# EAGLE design MST3K Billboard (EAGLE 9.1.3)
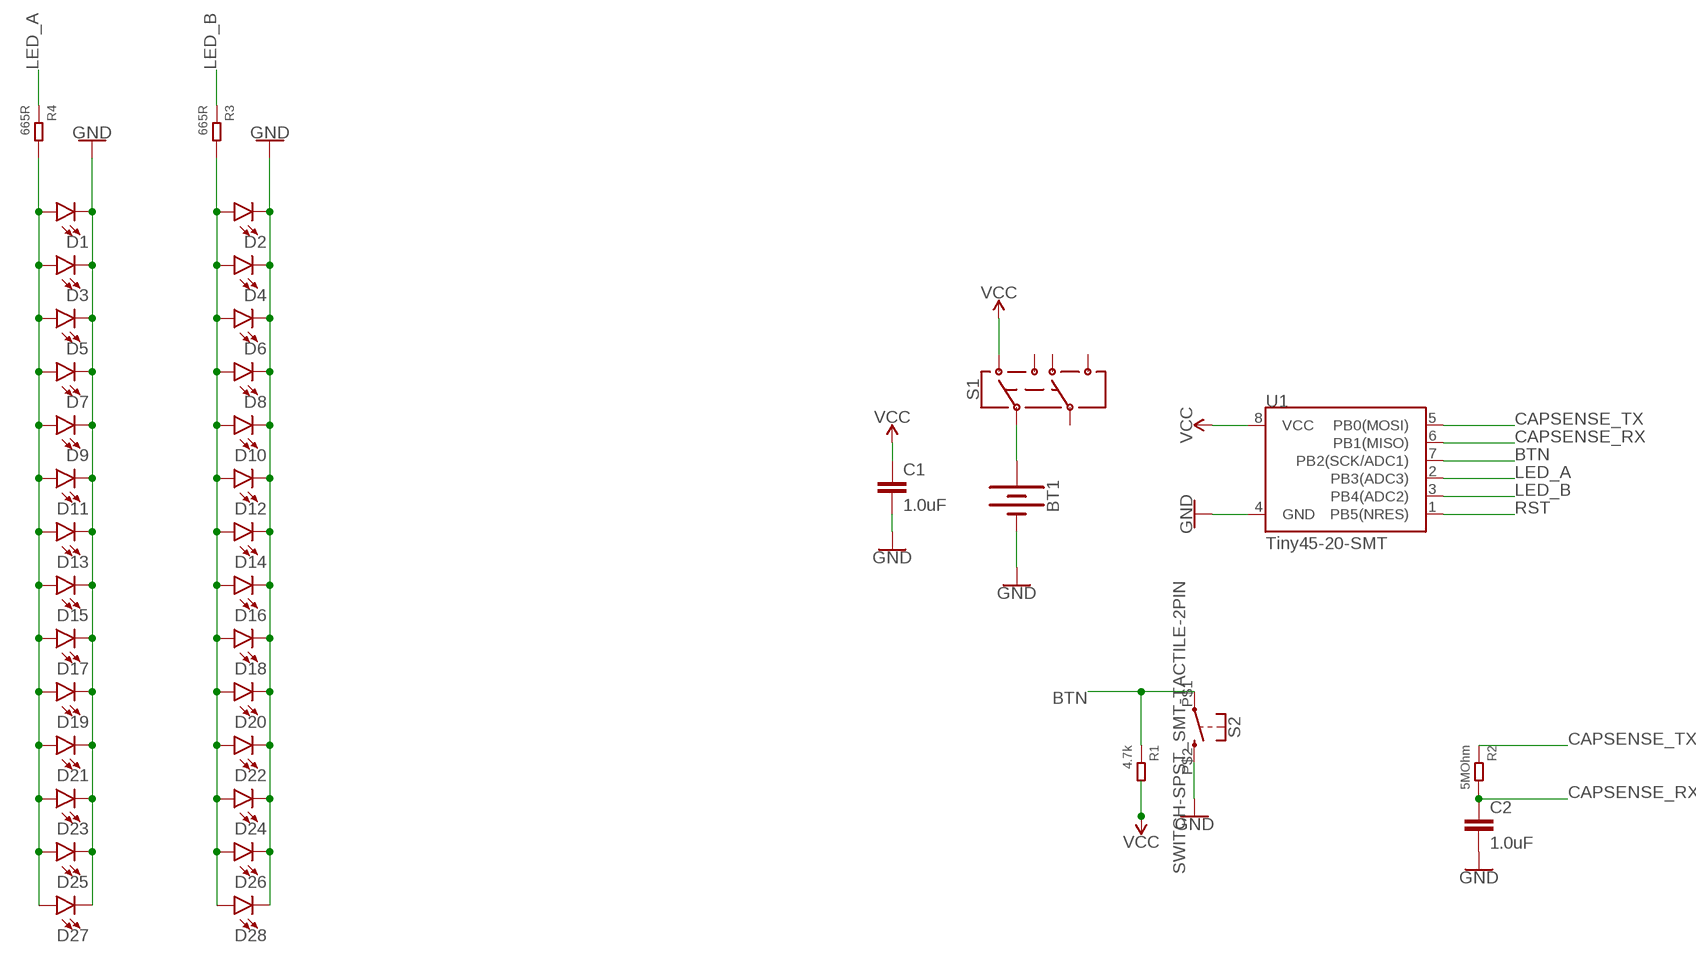
[diagram p0: schematic, sheet 1]

## Parts
BT1  BATTERY-20MM_SMD_4LEGS  [BATTCON_20MM_4LEGS]
C1  1.0uF  1.0UF-0805-25V-10%  [0805]
C2  1.0uF  1.0UF-0805-25V-10%  [0805]
D1  LED-3MM-NO_SILK  [LED_3MM-NS]
D2  LED-3MM-NO_SILK  [LED_3MM-NS]
D3  LED-3MM-NO_SILK  [LED_3MM-NS]
D4  LED-3MM-NO_SILK  [LED_3MM-NS]
D5  LED-3MM-NO_SILK  [LED_3MM-NS]
D6  LED-3MM-NO_SILK  [LED_3MM-NS]
D7  LED-3MM-NO_SILK  [LED_3MM-NS]
D8  LED-3MM-NO_SILK  [LED_3MM-NS]
D9  LED-3MM-NO_SILK  [LED_3MM-NS]
D10  LED-3MM-NO_SILK  [LED_3MM-NS]
D11  LED-3MM-NO_SILK  [LED_3MM-NS]
D12  LED-3MM-NO_SILK  [LED_3MM-NS]
D13  LED-3MM-NO_SILK  [LED_3MM-NS]
D14  LED-3MM-NO_SILK  [LED_3MM-NS]
D15  LED-3MM-NO_SILK  [LED_3MM-NS]
D16  LED-3MM-NO_SILK  [LED_3MM-NS]
D17  LED-3MM-NO_SILK  [LED_3MM-NS]
D18  LED-3MM-NO_SILK  [LED_3MM-NS]
D19  LED-3MM-NO_SILK  [LED_3MM-NS]
D20  LED-3MM-NO_SILK  [LED_3MM-NS]
D21  LED-3MM-NO_SILK  [LED_3MM-NS]
D22  LED-3MM-NO_SILK  [LED_3MM-NS]
D23  LED-3MM-NO_SILK  [LED_3MM-NS]
D24  LED-3MM-NO_SILK  [LED_3MM-NS]
D25  LED-3MM-NO_SILK  [LED_3MM-NS]
D26  LED-3MM-NO_SILK  [LED_3MM-NS]
D27  LED-3MM-NO_SILK  [LED_3MM-NS]
D28  LED-3MM-NO_SILK  [LED_3MM-NS]
R1  4.7k  SMD-RES-47R-5%-1/8W(0805)  [R0805]
R2  5MOhm  SMD-RES-47R-5%-1/8W(0805)  [R0805]
R3  665R  SMD-RES-47R-5%-1/8W(0805)  [R0805]
R4  665R  SMD-RES-47R-5%-1/8W(0805)  [R0805]
S1  SWITCH-DPDT-JS202011JCQN  [SWITCH_DPDT_SMD_JS202011JCQN]
S2  SWITCH-SPST_SMT-TACTILE-2PIN  [SMT_TACTILE_SWITCH_3X2MM]
U1  Tiny45-20-SMT  ATTINY45TINY45-20-SMT  [SO08-EIAJ_MCU]

## Nets
BTN: R1.1 S2.P$1 U1.7(PB2(SCK/ADC1))
CAPSENSE_RX: C2.1 R2.2 U1.6(PB1(MISO))
CAPSENSE_TX: R2.1 U1.5(PB0(MOSI))
GND: BT1.NEGATIVE(-) C1.2 C2.2 D1.K(C) D2.K(C) D3.K(C) D4.K(C) D5.K(C) D6.K(C) D7.K(C) D8.K(C) D9.K(C) D10.K(C) D11.K(C) D12.K(C) D13.K(C) D14.K(C) D15.K(C) D16.K(C) D17.K(C) D18.K(C) D19.K(C) D20.K(C) D21.K(C) D22.K(C) D23.K(C) D24.K(C) D25.K(C) D26.K(C) D27.K(C) D28.K(C) S2.P$2 U1.4(GND)
LED_A: R4.1 U1.2(PB3(ADC3))
LED_B: R3.1 U1.3(PB4(ADC2))
N$1: BT1.POSITIVE@1(+) BT1.POSITIVE@2(+) BT1.POSITIVE@3(+) BT1.POSITIVE@4(+) S1.P$2
OUT1: D1.A D3.A D5.A D7.A D9.A D11.A D13.A D15.A D17.A D19.A D21.A D23.A D25.A D27.A R4.2
OUT2: D2.A D4.A D6.A D8.A D10.A D12.A D14.A D16.A D18.A D20.A D22.A D24.A D26.A D28.A R3.2
RST: U1.1(PB5(NRES))
VCC: C1.1 R1.2 S1.P$1 U1.8(VCC)
Unconnected: S1.P$3 S1.P$4 S1.P$5 S1.P$6

## Library data of the parts
BT1 = SparkFun-Batteries:BATTERY: Battery - Single Cell A variety of battery chemistries, sizes, and footprints. Device List: 20MM_PTH - Coin Cell Battery Holder - 20mm (PTH) <https://www.sparkfun.com/products/783> 12MM_SMD - Coin Cell Battery Holder - 12mm (SMD) <https://www.sparkfun.com/products/10592> 12MM_PTH - Coin Cell Battery Holder - 12mm (PTH) <https://www.sparkfun.com/products/7948> 20MM_SMD - 20mm Coin Cell Battery Holder (SMD) (2 legs) Used on the Big Time Watch Kit <https://www.sparkfun.com/products/11734> 20MM_SMD_4LEGS - Coin Cell Battery Holder - 20mm (SMD) <https://www.sparkfun.com/products/11892> 20MM_SMD_4LEGS_OVERPASTE - Coin Cell Battery Holder - 20mm (SMD) <https://www.sparkfun.com/products/11892> (Over-paste on the legs) 24.5MM_PTH - Coin Cell Battery Holder - 24.5mm (PTH) <https://www.sparkfun.com/products/8863> 9V - 9V Battery Holder - PC Mount Used on the SparkFun SparkPunk Sound Kit <https://www.sparkfun.com/products/11177> and SparkFun SparkPunk Sequencer Kit <https://www.sparkfun.com/products/12707> 18650 - Battery Holder - 18650 (PTH) <https://www.sparkfun.com/products/13113> AA - Battery Holder - 1xAA (PTH) <https://www.sparkfun.com/products/7949> AAA - Battery Holder - 1xAAA (PTH) <https://www.sparkfun.com/products/12718> AA_KIT - Battery Holder - 1xAA (PTH) <https://www.sparkfun.com/products/7949> Special kit package - pads only have exposed copper on one side of the board. AAA_KIT - Battery Holder - 1xAAA (PTH) <https://www.sparkfun.com/products/12718> Special kit package - pads only have exposed copper on one side of the board.; PROD_ID: BATT-10373; SF_SKU: PRT-11892
C1 C2 = SparkFun-Capacitors:1.0UF: 1µF ceramic capacitors A capacitor is a passive two-terminal electrical component used to store electrical energy temporarily in an electric field.; PROD_ID: CAP-08064
D1-D28 = SparkFun-LED:LED: LED (Generic) Standard schematic elements and footprints for 5mm, 3mm, 1206, and 0603 sized LEDs. Generic LEDs with no color specified.
R1-R4 = Seeed-OPL-Resistor:SMD-RES-47R-5%-1/8W(0805): 301010380; MPN: RC0805JR-0747RL; VALUE: 47R
S1 = !CustomParts:SWITCH-DPDT: Double-Pole, Double-Throw (DPDT) Switch Double-pole, double-throw switches. Variant Overview PTH-GPI-152-3013 Used on SparkFun Geiger Counter <https://www.sparkfun.com/products/11345> SMD-AY0202 Surface Mount DPDT Switch <https://www.sparkfun.com/products/597> (COM-00597) Used on e.g. LilyPad Arduino USB - ATmega32U4 Board <https://www.sparkfun.com/products/12049>
S2 = !CustomParts:SWITCH-SPST_SMT-TACTILE-2PIN
U1 = SparkFun-Retired:ATTINY45: Atmel 8-pin 2/4/8kB flash uC Retired; PROD_ID: IC-08922

## Board
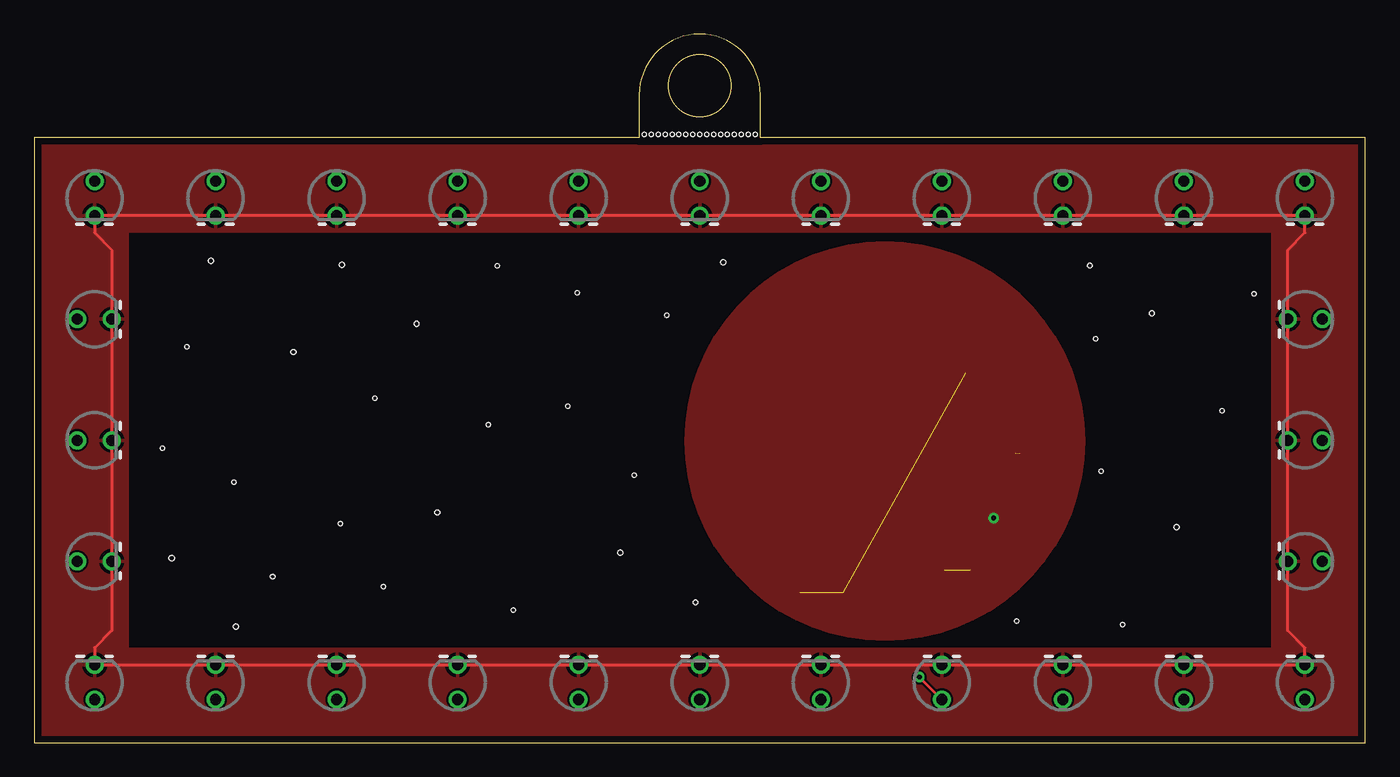
[diagram p1: board, top side]
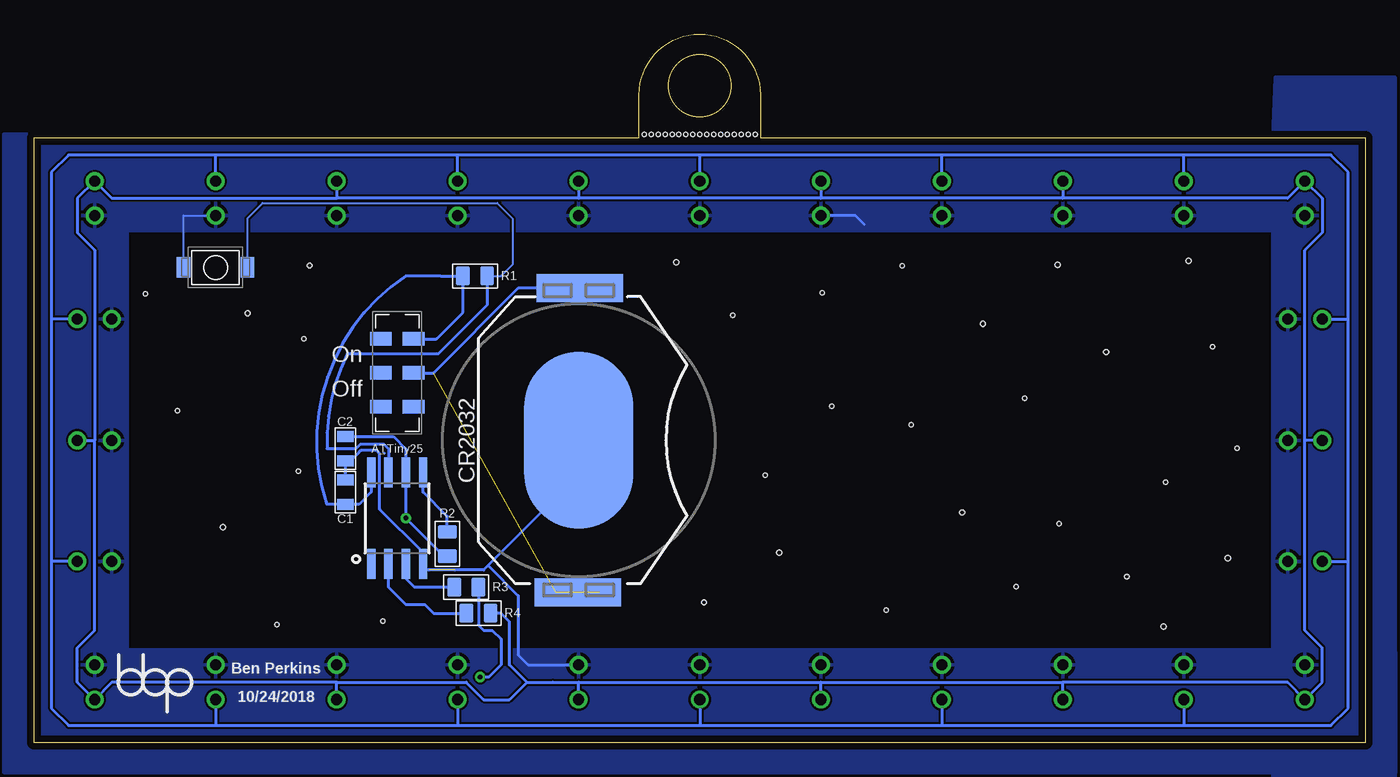
[diagram p2: board, bottom side, seen from below]

Size 97.79 x 52.07 mm. Coordinates in mm from the lower left corner, seen from the top.
Outline: 0,0 97.79,0 97.79,44.45 53.34,44.45 53.34,47.62 arc90 48.9,52.07 arc90 44.45,47.62 44.45,44.45 0,44.45 0,0
Outline: circle at 48.9,48.26 radius 2.29
Copper layers (1*16): Top 0.035mm / dielectric 1.5mm / Bottom 0.035mm
Design rules "default *": minimum track width 6mil, minimum drill 0.35mm, track to track 6mil, track to pad 6mil, pad to pad 6mil, via to via 6mil, smd to smd 6mil, copper to edge 20mil, drill to drill 6mil, minimum pad ring 10mil, minimum via ring 8mil, stop-mask expansion 4mil, vias tented up to drill 16mil, thermal gap 10mil
Holes 0.38 mm at 22.61,35.1 83.92,15.85 10.11,13.56 13,35.41 50.62,35.31
Holes 0.36 mm at 28.09,30.78 82.09,31.55 77.55,35.05 29.62,16.92 19.05,28.7 14.83,8.53 48.59,10.31 43.05,13.97
Holes 0.3 mm at 39.9,33.05 39.22,24.74 77.95,29.67 79.96,8.69 78.36,19.96 33.38,23.37 25.65,11.48 22.5,16.1 14.68,19.15 11.23,29.11 25.04,25.3 72.16,8.94 87.27,24.38 9.45,21.64 17.53,12.19 44.07,19.66 89.61,32.97 35.2,9.75 34.04,35.05 46.46,31.39 52.96,44.7 52.45,44.7 51.94,44.7 51.44,44.7 50.93,44.7 50.42,44.7 49.91,44.7 49.4,44.7 48.9,44.7 48.39,44.7 47.88,44.7 47.37,44.7 46.86,44.7 46.35,44.7 45.85,44.7 45.34,44.7 44.83,44.7
tRestrict: area 44.5,43.9 to 53.3,44.5
bRestrict: area 44.5,43.9 to 53.3,44.5

### Footprints (pad centres in the part's own frame; a part is rotated, then mirrored left to right if it is on the bottom)
BATTCON_20MM_4LEGS = smd 13 x 8: NEGATIVE 0,0 | smd 2.032 x 3.175: POSITIVE@1 -11.176,1.651; POSITIVE@2 -11.176,-1.524; POSITIVE@3 11.176,1.524; POSITIVE@4 11.176,-1.651
0805 = smd 0.8 x 1.2: 1 -0.9,0; 2 0.9,0
LED_3MM-NS = drill 0.813: A -1.27,0; K 1.27,0
R0805 = smd 1.397 x 1.016: 1 0,0.889; 2 0,-0.889
SWITCH_DPDT_SMD_JS202011JCQN = smd 1 x 1.6: P$1 -2.5,1.2; P$2 0,1.2; P$3 2.5,1.2; P$4 -2.5,-1.2; P$5 0,-1.2; P$6 2.5,-1.2
SMT_TACTILE_SWITCH_3X2MM = smd 1 x 1.5: P$1 -2.35,0; P$2 2.35,0
SO08-EIAJ_MCU = smd 0.61 x 2.21: 1 -1.905,-3.378; 2 -0.635,-3.378; 3 0.635,-3.378; 4 1.905,-3.378; 5 1.905,3.353; 6 0.635,3.353; 7 -0.635,3.353; 8 -1.905,3.353

### Placement (x,y rotation side)
BT1  57.78,22.23 90 bottom
C1  74.93,18.41 90 bottom
C2  74.93,21.59 270 bottom
D1  4.45,4.45 90 top
D2  13.34,4.45 90 top
D3  22.23,4.45 90 top
D4  31.11,4.45 90 top
D5  40.01,4.45 90 top
D6  48.9,4.45 90 top
D7  57.78,4.45 90 top
D8  66.67,4.45 90 top
D9  75.56,4.45 90 top
D10  84.45,4.45 90 top
D11  93.34,4.45 90 top
D12  93.34,13.34 180 top
D13  93.34,22.23 180 top
D14  93.34,31.11 180 top
D15  93.34,40.01 270 top
D16  84.45,40.01 270 top
D17  75.56,40.01 270 top
D18  66.67,40.01 270 top
D19  57.78,40.01 270 top
D20  48.9,40.01 270 top
D21  40.01,40.01 270 top
D22  31.11,40.01 270 top
D23  22.23,40.01 270 top
D24  13.34,40.01 270 top
D25  4.45,40.01 270 top
D26  4.45,31.11 0 top
D27  4.45,22.23 0 top
D28  4.45,13.34 0 top
R1  65.41,34.29 270 bottom
R2  67.44,14.61 0 bottom
R3  66.04,11.43 90 bottom
R4  65.15,9.53 90 bottom
S1  71.12,27.18 270 bottom
S2  84.45,34.92 180 bottom
U1  71.12,16.51 0 bottom

### Tracks (layer width: path | path; a pad name or v marks a point on that pad's centre or on a via)
BTN
  Bottom 0.152: S2.P$1 82.11,38.55 81,39.65 63.78,39.65 62.61,38.48 62.61,35.18 63.5,34.29 R1.1
  Bottom 0.203: U1.7 71.75,21.59 72.11,21.95 73.81,21.95 74.16,21.59 76.28,21.59 arc28 74.78,28.57 68.1,28.57 64.52,32.16 R1.1
CAPSENSE_RX  (via drill 0.35)
  Bottom 0.203: 70.48,20.32 U1.6 v70.48,16.51 67.69,13.72 R2.2 | 70.48,20.32 70.48,20.95 | C2.1 71.39,22.49 70.48,21.59 70.48,20.32
  pour Top: 62.48,7.56 arc-90 47.88,22.16 arc-90 62.48,36.77 arc-90 77.09,22.16 arc-90
CAPSENSE_TX
  Bottom 0.203: U1.5 69.22,18.41 67.44,16.64 R2.1
GND  (2 unrouted)
  Top 0.203: D16.K 83.82,38.73 | 83.82,38.73 D17.K D18.K D19.K D20.K D21.K D22.K D23.K D24.K D25.K 4.45,37.47 5.71,36.2 D26.K D27.K D28.K 5.71,8.26 4.45,6.99 D1.K D2.K D3.K D4.K D5.K D6.K D7.K D8.K D9.K D10.K D11.K 93.34,6.99 92.08,8.26 D12.K D13.K D14.K 92.08,36.2 93.34,37.47 D15.K 83.82,38.73
  Bottom 0.152: S2.P$2 86.81,38.73 D16.K
  Bottom 0.203: 36.83,38.1 37.47,38.73 D21.K | 57.78,18.41 BT1.NEGATIVE 57.78,19.68 64.45,13.02 | 87,35.12 S2.P$2 | C1.2 C2.2 74.56,20.69 73.98,21.27 73.79,21.46 72.64,21.46 72.39,21.21 72.39,17.14 69.22,13.97 U1.4 69.22,12.7 68.78,12.7 64.77,12.7 64.45,13.02 | 60.33,5.71 D7.K 61.49,5.71 62.23,6.45 62.23,10.79 64.45,13.02 | 72.07,21.27 | 66.88,12.7
  pour Bottom: 0,37.59 90.93,37.59 90.93,6.86 6.67,6.86 -2.22,6.67 -2.22,-2.22 100.01,-2.22 100.01,44.77 0,44.77
  pour Bottom: 6.86,44.45 6.86,-4.45 -2.22,-4.45 -2.22,48.9 6.67,48.9
  pour Top: 0,37.59 90.93,37.59 90.93,6.86 6.67,6.86 -2.22,6.67 -2.22,-2.22 100.01,-2.22 100.01,44.77 0,44.77
  pour Top: 6.86,44.45 6.86,-4.45 -2.22,-4.45 -2.22,48.9 6.67,48.9
LED_A
  Bottom 0.203: R4.1 68.45,9.53 69.09,10.16 70.48,10.16 71.75,11.43 U1.2
LED_B
  Bottom 0.203: U1.3 70.48,12.06 69.85,11.43 R3.1
N$1  (2 unrouted)
  Bottom 0.203: S1.P$2 68.45,27.18 62.23,33.4 BT1.POSITIVE@3 BT1.POSITIVE@4
OUT1
  Bottom 0.203: D9.A 75.56,4.45 | 75.56,4.45 66.04,4.45 64.77,3.17 62.87,3.17 61.59,4.45 | 57.78,4.45 59.69,4.45 61.59,4.45 | 57.78,4.45 40.01,4.45 | 40.01,4.45 22.23,4.45 | 4.45,22.23 4.45,8.26 3.17,6.99 3.17,4.45 D1.A 5.71,4.45 22.23,4.45 | 4.45,22.23 4.45,36.2 3.17,37.47 3.17,40.01 D25.A 5.71,40.01 22.23,40.01 | 22.23,40.01 40.01,40.01 | 40.01,40.01 57.78,40.01 | 57.78,40.01 75.56,40.01 | D17.A 75.56,40.01 | D19.A 57.78,40.01 | D21.A 40.01,40.01 | D23.A 22.23,40.01 | D27.A 4.45,22.23 | D3.A 22.23,4.45 | D5.A 40.01,4.45 | D7.A 57.78,4.45 | 93.34,17.78 93.34,8.26 94.61,6.99 94.61,4.45 D11.A 92.08,4.45 75.56,4.45 | 93.34,17.78 93.34,22.23 | D13.A 93.34,22.23 | 93.34,17.4 93.34,17.78 | 75.56,40.01 92.08,40.01 D15.A 94.61,40.01 94.61,37.47 93.34,36.2 93.34,22.23 | 61.59,4.45 62.87,5.71 62.87,8.89 63.5,9.53 R4.2
OUT2  (via drill 0.35)
  Top 0.203: v65.02,4.83 D8.A
  Bottom 0.203: 84.45,1.27 66.67,1.27 | 66.67,1.27 48.9,1.27 | 48.9,1.27 31.11,1.27 | 31.11,1.27 13.34,1.27 | 13.34,1.27 2.54,1.27 1.27,2.54 1.27,13.34 | 1.27,13.34 1.27,31.11 | 1.27,31.11 1.27,41.91 2.54,43.18 13.34,43.18 | 84.45,1.27 95.25,1.27 96.52,2.54 96.52,13.34 | 13.34,43.18 31.11,43.18 | 31.11,43.18 48.9,43.18 | 48.9,43.18 66.67,43.18 | 66.67,43.18 76.2,43.18 84.45,43.18 | 84.45,43.18 95.25,43.18 96.52,41.91 96.52,31.11 | 96.52,31.11 96.52,13.34 | D10.A 84.45,1.27 | D8.A 66.67,1.27 | D6.A 48.9,1.27 | D4.A 31.11,1.27 | D2.A 13.34,1.27 | D28.A 1.27,13.34 | D26.A 1.27,31.11 | D24.A 13.34,43.18 | D22.A 31.11,43.18 | D20.A 48.9,43.18 | D18.A 66.67,43.18 | D16.A 84.45,43.18 | D14.A 96.52,31.11 | D12.A 96.52,13.34 | v65.02,4.83 64.39,4.83 63.5,5.71 63.5,7.62 64.14,8.26 64.77,8.26 65.15,8.64 R3.2 65.41,11.18
VCC
  Bottom 0.203: U1.8 73.03,18.41 73.92,17.52 C1.1 76.29,17.52 arc75 70.48,34.29 67.94,34.29 R1.2 66.29,31.62 68.24,29.68 S1.P$1

### Text on the board
bPlace: Ben Perkins | 10/24/2018
bNames: On | Off | CR2032 | ATTiny25